# Altium schematic sheet ESIMA E-Meter_CPUBlock.SchDoc: Esima E-Meter CPU Blockdiagramm
size A4; DrawnBy: Jürgen Merz; Address1: Wilhelm- Schickard- Strasse 10; Address2: 78052 Villingen Schwenningen; Address3: juergen.merz@hsg-imit.de; Address4: Tel. +49 7721 943 138; PhoneNumber: +49 7721 943 138; FaxNumber: +49 7721 943 140
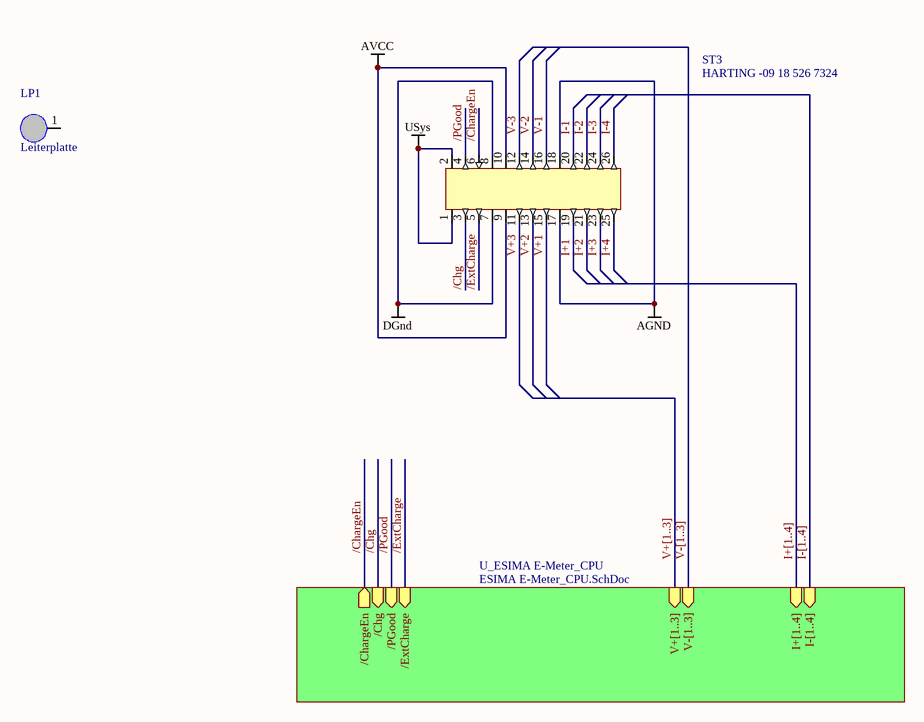
[diagram p0: ESIMA E-Meter_CPUBlock.SchDoc]

## Parts
LP1  Leiterplatte
ST3  HARTING -09 18 526 7324  [HARTING -09 18 526 7324]

## Sub-sheets
U_ESIMA E-Meter_CPU = ESIMA E-Meter_CPU.SchDoc: V+[1..3] (in), V-[1..3] (in), I+[1..4] (in), I-[1..4] (in), /PGood (in), /Chg (in), /ChargeEn (out), /ExtCharge (in)

## Nets
AGND: ST3.17 ST3.18
AVCC: ST3.9 ST3.10
DGnd: ST3.7 ST3.8
USys: ST3.1 ST3.2
/ChargeEn: ST3.6 ; sheet U_ESIMA E-Meter_CPU//ChargeEn
/Chg: ST3.3 ; sheet U_ESIMA E-Meter_CPU//Chg
/ExtCharge: ST3.5 ; sheet U_ESIMA E-Meter_CPU//ExtCharge
/PGood: ST3.4 ; sheet U_ESIMA E-Meter_CPU//PGood
I+1: ST3.19
I+2: ST3.21
I+3: ST3.23
I+4: ST3.25
I-1: ST3.20
I-2: ST3.22
I-3: ST3.24
I-4: ST3.26
V+1: ST3.15
V+2: ST3.13
V+3: ST3.11
V-1: ST3.16
V-2: ST3.14
V-3: ST3.12

Not connected (* = marked no-connect by the designer): LP1 1

## Buses and harness runs
bus I+[1..4] = sheet U_ESIMA E-Meter_CPU/I+[1..4]
bus I-[1..4] = sheet U_ESIMA E-Meter_CPU/I-[1..4]
bus V+[1..3] = sheet U_ESIMA E-Meter_CPU/V+[1..3]
bus V-[1..3] = sheet U_ESIMA E-Meter_CPU/V-[1..3]

## Notes on the sheet
- Title
- Size:
- Date:
- A4
- Number:
- Time:
- Revision:
- Sheet
- of
- File:

## Library data of the parts
LP1 = Passmarke 1mm: Platzhalter für Leiterplatte PCB-Pool in Stückliste
ST3 = Stecker 26Pol zweireihig universal: Supplier 1: Farnell; Supplier Part Number 1: 1106836